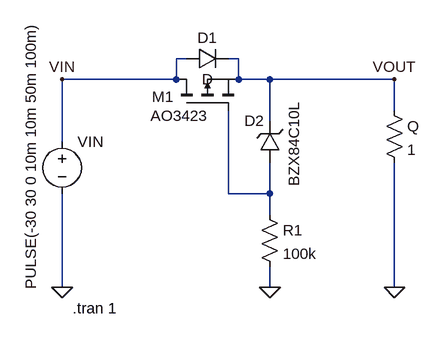
[diagram p0: schematic Inversao.asc]
Inversao.asc, the LTspice schematic file:
Version 4
SHEET 1 880 680
WIRE 80 64 64 64
WIRE 160 64 144 64
WIRE 64 96 64 64
WIRE 64 96 -112 96
WIRE 160 96 160 64
WIRE 160 96 144 96
WIRE 208 96 160 96
WIRE 400 96 208 96
WIRE 400 144 400 96
WIRE 208 160 208 96
WIRE -112 192 -112 96
WIRE 144 272 144 144
WIRE 208 272 208 224
WIRE 208 272 144 272
WIRE 208 304 208 272
WIRE -112 416 -112 272
WIRE 208 416 208 384
WIRE 400 416 400 224
FLAG 208 416 0
FLAG 400 416 0
FLAG -112 416 0
FLAG 400 96 VOUT
FLAG -112 96 VIN
SYMBOL zener 224 224 R180
WINDOW 0 24 64 Left 2
WINDOW 3 -21 -37 VRight 2
SYMATTR InstName D2
SYMATTR Value BZX84C10L
SYMBOL res 192 288 R0
SYMATTR InstName R1
SYMATTR Value 100k
SYMBOL res 384 128 R0
SYMATTR InstName Q
SYMATTR Value 1
SYMBOL voltage -112 176 R0
WINDOW 3 -48 -170 VRight 2
WINDOW 123 0 0 Left 0
WINDOW 39 0 0 Left 0
SYMATTR InstName VIN
SYMATTR Value PULSE(-30 30 0 10m 10m 50m 100m)
SYMBOL pmos 64 144 R270
WINDOW 0 21 -37 VRight 2
WINDOW 3 -8 -40 VRight 2
SYMATTR InstName M1
SYMATTR Value AO3423
SYMBOL diode 80 80 R270
WINDOW 0 32 32 VTop 2
WINDOW 3 0 32 VBottom 2
SYMATTR InstName D1
TEXT -96 448 Left 2 !.tran 1

The netlist it stands for:
* Inversao.asc
D2 N001 VOUT BZX84C10L
R1 N001 0 100k
R§Q VOUT 0 1
VIN VIN 0 PULSE(-30 30 0 10m 10m 50m 100m)
M1 VIN N001 VOUT VOUT AO3423
D1 VIN VOUT D
.model D D
.lib standard.dio
.model NMOS NMOS
.model PMOS PMOS
.lib standard.mos
.tran 1
.backanno
.end